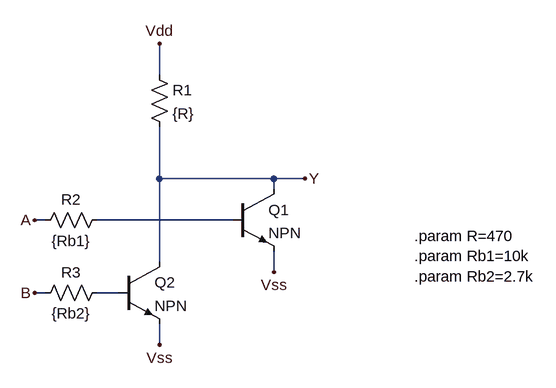
[diagram p0: schematic nor.asc]
nor.asc, the LTspice schematic file:
Version 4
SHEET 1 880 680
WIRE -544 -224 -544 -272
WIRE -544 -64 -544 -144
WIRE -368 -64 -544 -64
WIRE -320 -64 -368 -64
WIRE -368 -48 -368 -64
WIRE -720 0 -736 0
WIRE -432 0 -640 0
WIRE -544 64 -544 -64
WIRE -368 80 -368 48
WIRE -720 112 -736 112
WIRE -608 112 -640 112
WIRE -544 192 -544 160
FLAG -320 -64 Y
FLAG -544 192 Vss
FLAG -544 -272 Vdd
FLAG -736 112 B
FLAG -736 0 A
FLAG -368 80 Vss
SYMBOL npn -432 -48 R0
SYMATTR InstName Q1
SYMBOL npn -608 64 R0
SYMATTR InstName Q2
SYMBOL res -560 -240 R0
SYMATTR InstName R1
SYMATTR Value {R}
SYMBOL res -624 -16 R90
WINDOW 0 0 56 VBottom 2
WINDOW 3 32 56 VTop 2
SYMATTR InstName R2
SYMATTR Value {Rb1}
SYMBOL res -624 96 R90
WINDOW 0 0 56 VBottom 2
WINDOW 3 32 56 VTop 2
SYMATTR InstName R3
SYMATTR Value {Rb2}
TEXT -152 24 Left 2 !.param R=470\n.param Rb1=10k\n.param Rb2=2.7k

The netlist it stands for:
* nor.asc
Q1 Y N001 Vss 0 NPN
Q2 Y N002 Vss 0 NPN
R1 Vdd Y {R}
R2 N001 A {Rb1}
R3 N002 B {Rb2}
.model NPN NPN
.model PNP PNP
.lib standard.bjt
.param R=470
.param Rb1=10k
.param Rb2=2.7k
.backanno
.end